# EAGLE design Side_Panel_f1 (EAGLE 9.0.0)
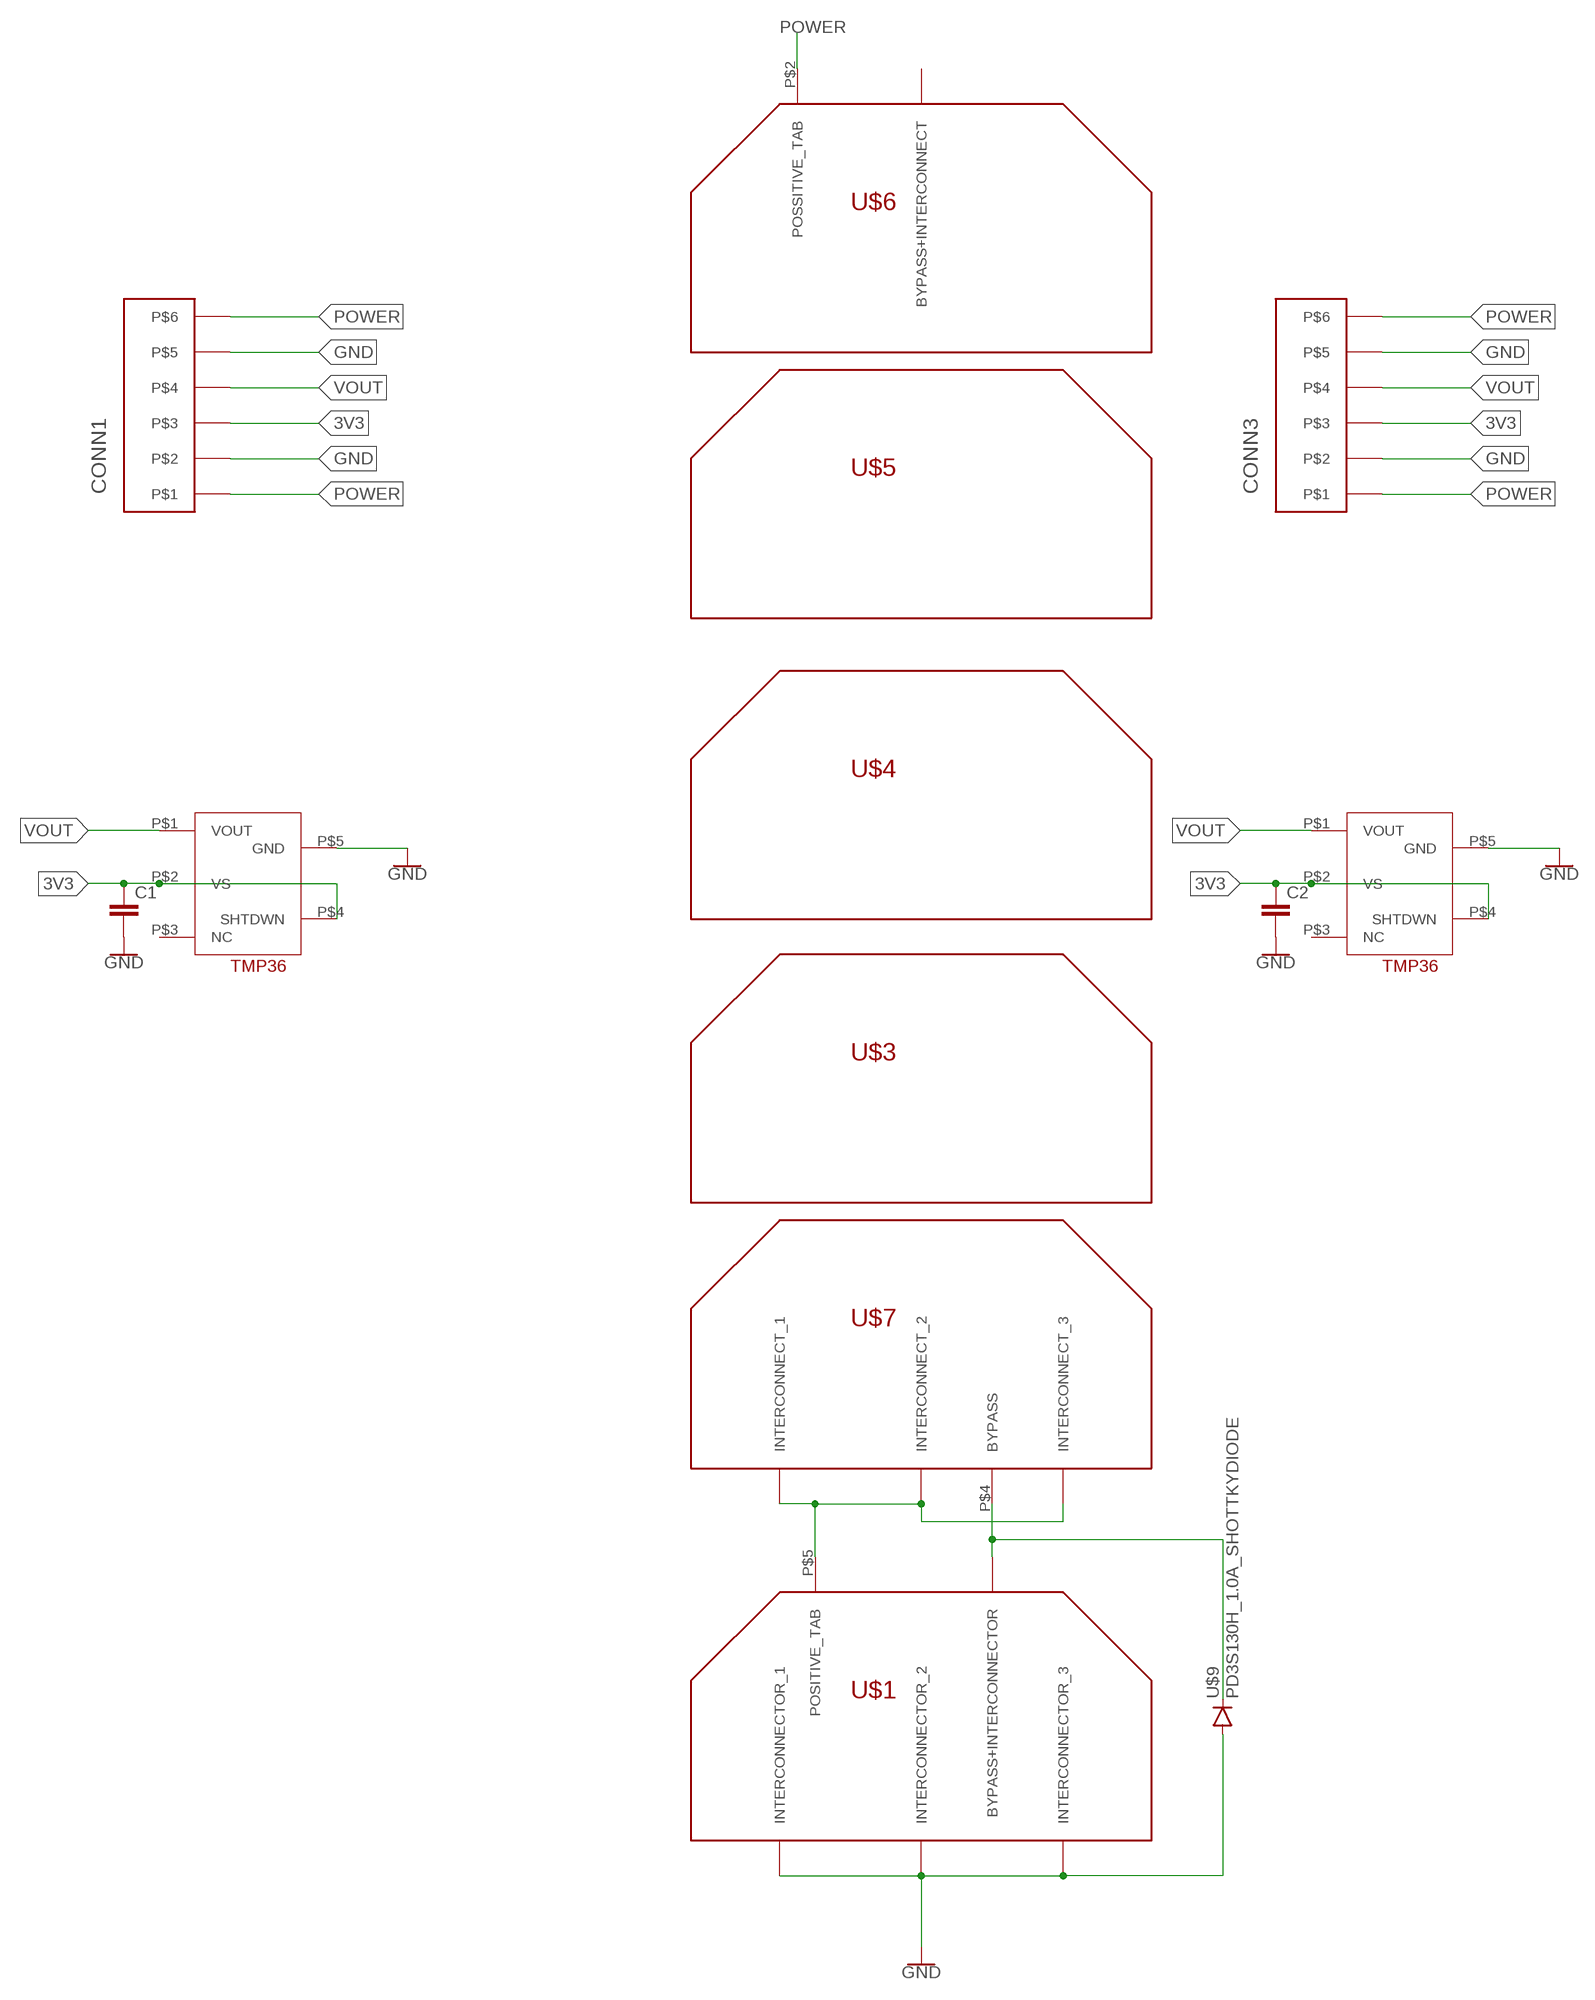
[diagram p0: schematic, sheet 1]

## Parts
C1  CAPACITOR0805  [0805]
C2  CAPACITOR0805  [0805]
CONN1  PICOLOCK_6PICOLOCK_6  [PICOLOCK_6]
CONN3  PICOLOCK_6PICOLOCK_6  [PICOLOCK_6]
U$1  SOLAR_CELL_STAND-ALONE  [SOLAR_CELL_STAND-ALONE]
U$2  TMP36  [SOT-23-5]
U$3  SOALAR_CELL_OUTLINE  [SOLAR_CELL_OUTLINE]
U$4  SOALAR_CELL_OUTLINE  [SOLAR_CELL_OUTLINE]
U$5  SOALAR_CELL_OUTLINE  [SOLAR_CELL_OUTLINE]
U$6  SOLAR_CELL_TOP  [SOLAR_CELL_TOP_SHORT-PAD]
U$7  SOLAR_CELL_BOTTOM+BYPASS  [SOLAR_CELL_BOTTOM+BYPASS]
U$8  TMP36  [SOT-23-5]
U$9  PD3S130H_1.0A_SHOTTKYDIODE  [POWERDI_323]

## Nets
3V3: C1.1 C2.1 CONN1.P$3 CONN3.P$3 U$2.P$2(VS) U$2.P$4(SHTDWN) U$8.P$2(VS) U$8.P$4(SHTDWN)
GND: C1.2 C2.2 CONN1.P$2 CONN1.P$5 CONN3.P$2 CONN3.P$5 U$1.P$1(INTERCONNECTOR_1) U$1.P$2(INTERCONNECTOR_2) U$1.P$3(INTERCONNECTOR_3) U$2.P$5(GND) U$8.P$5(GND) U$9.P$2(A)
N$9: U$1.P$4(BYPASS+INTERCONNECTOR) U$7.P$4(BYPASS) U$9.P$1(C)
N$10: U$1.P$5(POSITIVE_TAB) U$7.P$1(INTERCONNECT_1) U$7.P$2(INTERCONNECT_2) U$7.P$3(INTERCONNECT_3)
POWER: CONN1.P$1 CONN1.P$6 CONN3.P$1 CONN3.P$6 U$6.P$2(POSSITIVE_TAB)
VOUT: CONN1.P$4 CONN3.P$4 U$2.P$1(VOUT) U$8.P$1(VOUT)
Unconnected: U$2.P$3(NC) U$6.P$1(BYPASS+INTERCONNECT) U$8.P$3(NC)

## Library data of the parts
C1 C2 = DubSat1 Components:CAPACITOR: Capacitor Standard 0603 ceramic capacitor, and 0.1" leaded capacitor.
CONN1 CONN3 = DubSat1 Components:PICOLOCK_6
U$1 = DubSat1 Components:SOLAR_CELL_STAND-ALONE
U$2 U$8 = DubSat1 Components:TMP36
U$3-U$5 = DubSat1 Components:SOALAR_CELL_OUTLINE: Azurspace Solar Cell: http://www.azurspace.com/images/products/0003401-01-01_DB_3G30A.pdf Contains an outline of the solar cell without any pads because the interconnectors will be attached externaly and not on the board. This footprint is to be used as the center cells in a string of cells.
U$6 = DubSat1 Components:SOLAR_CELL_TOP: Azurspace solar cell: http://www.azurspace.com/images/products/0003401-01-01_DB_3G30A.pdf With outline of full cell + pad for top side introconnector and integrated bypass diode. To be used as the top cell in a string of cells.
U$7 = DubSat1 Components:SOLAR_CELL_BOTTOM+BYPASS
U$9 = DubSat1 Components:PD3S130H_1.0A_SHOTTKYDIODE

## Board
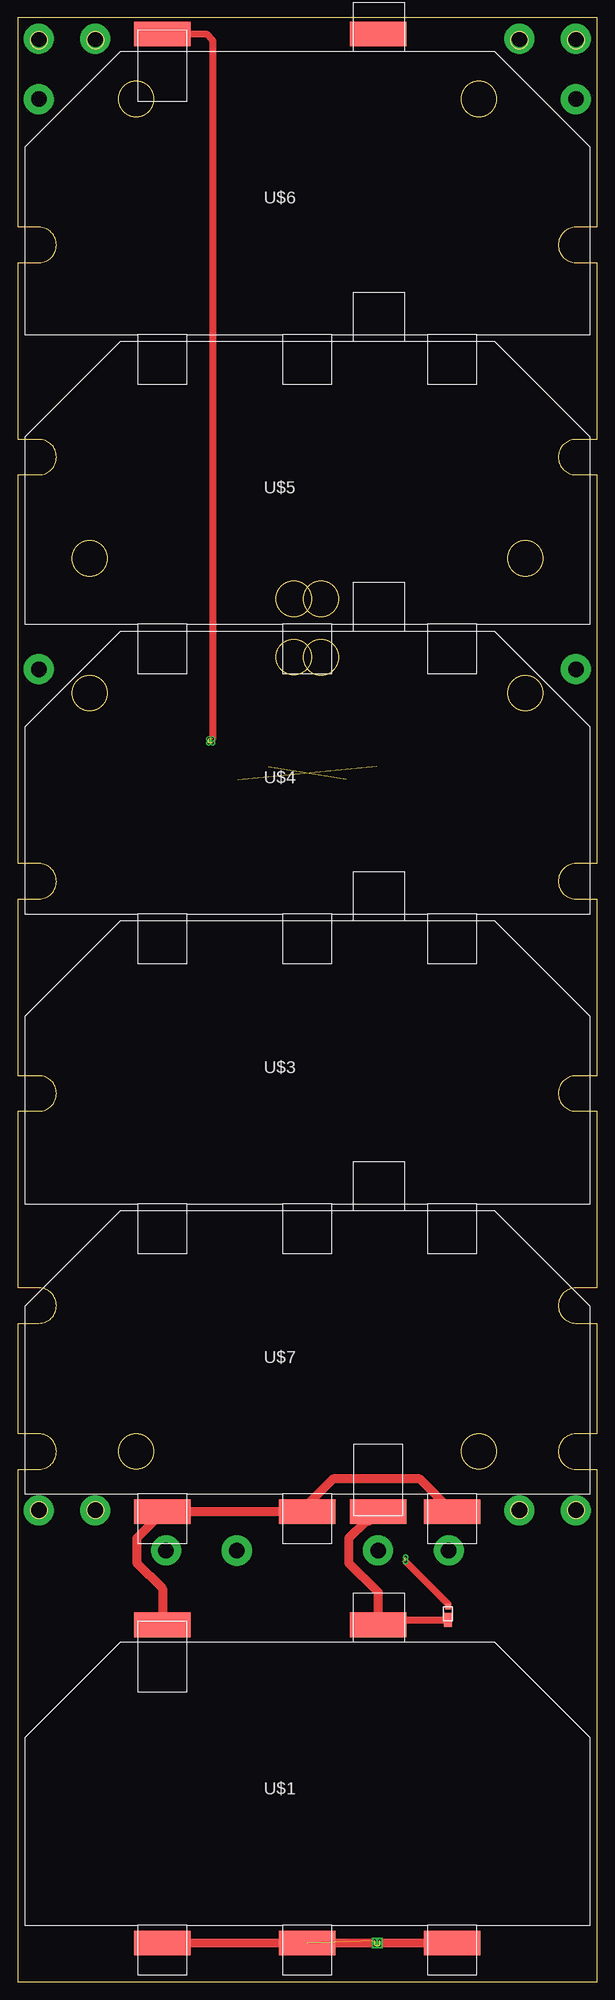
[diagram p1: board, top side]
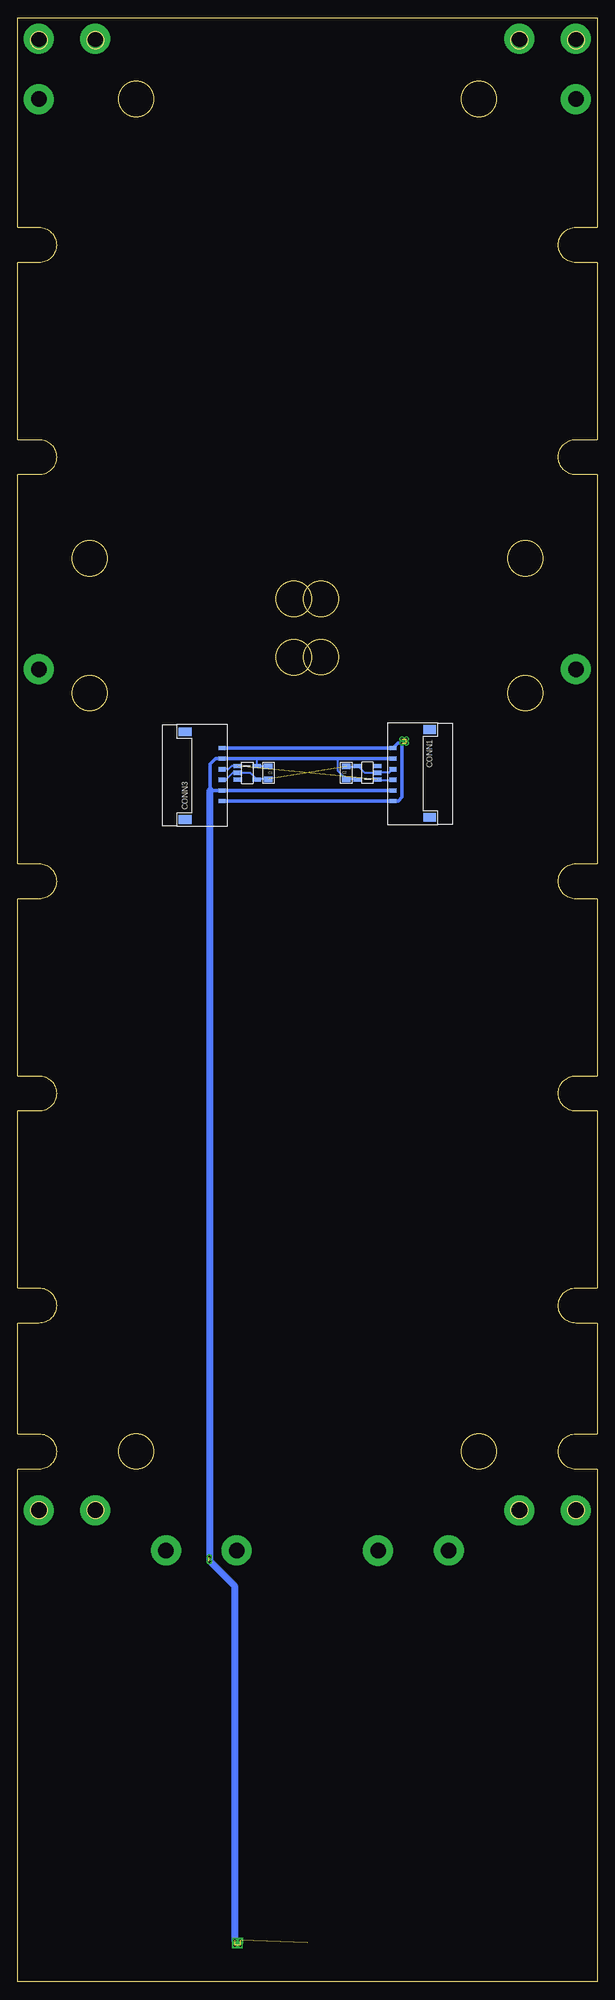
[diagram p2: board, bottom side, seen from below]

Size 82 x 277.8 mm. Coordinates in mm from the lower left corner, seen from the top.
Outline: 79,248.15 arc180 79,243.15 82,243.15 82,218.15 79,218.15 arc180 79,213.15 82,213.15 82,158.15 79,158.15 arc180 79,153.15 82,153.15 82,128.15 79,128.15 arc180 79,123.15 82,123.15 82,98.15 79,98.15 arc180 79,93.15 82,93.15 82,77.5 79,77.5 arc180 79,72.5 82,72.5 82,0 0,0 0,72.5 3,72.5 arc180 3,77.5 0,77.5 0,93.15 3,93.15 arc180 3,98.15 0,98.15 0,123.15 3,123.15 arc180 3,128.15 0,128.15 0,153.15 3,153.15 arc180 3,158.15 0,158.15 0,213.15 3,213.15 arc180 3,218.15 0,218.15 0,243.15 3,243.15 arc180 3,248.15 0,248.15 0,277.8 82,277.8 82,248.15 79,248.15
Outline: circle at 65.26,75 radius 2.5
Outline: circle at 65.26,266.3 radius 2.5
Outline: circle at 16.74,75 radius 2.5
Outline: circle at 16.74,266.3 radius 2.5
Outline: circle at 3,274.6 radius 1.19
Outline: circle at 11,274.6 radius 1.19
Outline: circle at 11,66.7 radius 1.19
Outline: circle at 3,66.7 radius 1.19
Outline: circle at 71,66.7 radius 1.19
Outline: circle at 79,66.7 radius 1.19
Outline: circle at 71,274.6 radius 1.19
Outline: circle at 79,274.6 radius 1.19
Outline: circle at 71.83,182.28 radius 2.5
Outline: circle at 42.93,187.34 radius 2.5
Outline: circle at 42.93,195.61 radius 2.5
Outline: circle at 71.83,201.32 radius 2.5
Outline: circle at 39.07,195.61 radius 2.5
Outline: circle at 39.07,187.35 radius 2.5
Outline: circle at 10.18,201.32 radius 2.5
Outline: circle at 10.18,182.28 radius 2.5
Copper layers (1*16): Top 0.035mm / dielectric 1.5mm / Bottom 0.035mm
Design rules "default": minimum track width 10mil, minimum drill 24mil, track to track 8mil, track to pad 8mil, pad to pad 8mil, via to via 8mil, smd to smd 8mil, copper to edge 40mil, drill to drill 8mil, minimum pad ring 10mil, minimum via ring 8mil, stop-mask expansion 4mil, vias tented up to drill 0mil, thermal gap 10mil

### Footprints (pad centres in the part's own frame; a part is rotated, then mirrored left to right if it is on the bottom)
0805 = smd 0.8 x 1.2: 1 -0.9,0; 2 0.9,0
PICOLOCK_6 = smd 1.25 x 1.8: MNT@1 -2.605,5.2; MNT@2 9.805,5.2 | smd 0.6 x 1: P$1 0,0; P$2 1.5,0; P$3 3,0; P$4 4.5,0; P$5 6,0; P$6 7.5,0
SOLAR_CELL_STAND-ALONE = smd 8 x 3.5: P$1 19.5,-2.5; P$2 40,-2.5; P$3 60.5,-2.5; P$4 50,42.5; P$5 19.5,42.5
SOT-23-5 = smd 0.6 x 1.2: P$1 -0.95,-1.35; P$2 0,-1.35; P$3 0.95,-1.35; P$4 0.95,1.35; P$5 -0.95,1.35
SOLAR_CELL_TOP_SHORT-PAD = smd 8 x 3.5: P$1 50,42.5; P$2 19.5,42.5
SOLAR_CELL_BOTTOM+BYPASS = smd 8 x 3.5: P$1 19.5,-2.5; P$2 40,-2.5; P$3 60.5,-2.5; P$4 50,-2.5
POWERDI_323 = smd 2 x 1.1: P$1 -1.25,0 | smd 0.8 x 0.8: P$2 0.65,0

### Placement (x,y rotation side)
C1  46.5,171 90 bottom
C2  35.5,171 270 bottom
CONN1  28.9,174.5 270 bottom
CONN3  53.1,167 90 bottom
U$1  1,8 0 top
U$2  49.5,171 270 bottom
U$3  1,110 0 top
U$4  1,151 0 top
U$5  1,192 0 top
U$6  1,233 0 top
U$7  1,69 0 top
U$8  32.5,171 90 bottom
U$9  60.9,52.44 90 top

### Tracks (layer width: path | path; a pad name or v marks a point on that pad's centre or on a via)
3V3  (1 unrouted)
  Bottom 0.305: C2.1 33.9,171.9 U$8.P$4 32.9,171 U$8.P$2 29.4,171 CONN1.P$3 | C1.1 48.1,170.1 U$2.P$4 49.1,171 U$2.P$2 51.52,171 52.55,169.97 53.07,169.97 CONN3.P$3
GND  (via drill 0.35)  (5 unrouted)
  Top 0.305: 60.9,53.43 U$9.P$2
  Top 1.016: v54.9,59.44 60.9,53.43
  Top 1.27: U$1.P$1 U$1.P$2 U$1.P$3
  Bottom 0.305: CONN1.P$2 36.66,173 36.66,171.26 C2.2 33.9,170.1 U$8.P$5 | CONN3.P$5 48.13,173 48.15,172.98 U$2.P$5 48.1,171.9 C1.2 | 54.77,59.44 v54.9,59.44
  Bottom 0.508: CONN1.P$2 CONN3.P$5 54,173 54.77,172.23 54.77,168.54 54.73,168.5 CONN3.P$2 CONN1.P$5
  Bottom 1.016: v51.25,5.85 51.25,55.92 54.77,59.44 54.77,168.54
  other vias: 50.5,5.85 50.52,5.15 51.25,5.15 54.89,60.05
N$1  (via drill 2.2 pad 4.24)
  other vias: 3,274.8
N$2  (via drill 2.2 pad 4.24)
  other vias: 11,274.8
N$3  (via drill 2.2 pad 4.24)
  other vias: 3,66.7 61,61 21,61
N$4  (via drill 2.2 pad 4.24)
  other vias: 11,66.7 51,61
N$5  (via drill 2.2 pad 4.24)
  other vias: 79,274.8 79,266.3 3,266.3 79,185.65 3,185.65
N$6  (via drill 2.2 pad 4.24)
  other vias: 71,274.8
N$7  (via drill 2.2 pad 4.24)
  other vias: 79,66.7
N$8  (via drill 2.2 pad 4.24)
  other vias: 71,66.7
N$9
  Top 0.305: U$1.P$4 arc-90 51.69,51.19
  Top 1.016: 51.69,51.19 U$9.P$1
  Top 1.27: U$7.P$4 49.65,65.15 49.28,65.15 46.85,62.72 46.85,59.28 51,55.13 U$1.P$4
N$10
  Top 1.27: U$1.P$5 20.5,55.63 16.85,59.28 16.85,62.72 20.5,66.37 U$7.P$1 U$7.P$2 41,67.5 44.6,71.1 56.9,71.1 U$7.P$3
N$11  (via drill 2.2 pad 4.27)
  other vias: 31,61
POWER  (via drill 0.3)  (3 unrouted)
  Top 1.016: v27.6,175.8 27.6,274.6 26.7,275.5 U$6.P$2 21,276
  Bottom 0.508: CONN3.P$1 CONN1.P$6 28.15,167.01 27.6,167.56 v27.6,175.2 28.2,175.2 CONN1.P$1 CONN3.P$6
  other vias: 27,175.8 27,175.2
VOUT  (1 unrouted)
  Bottom 0.305: U$8.P$1 31.1,170 CONN1.P$4 | U$2.P$1 51.71,171.95 52.16,171.5 CONN3.P$4